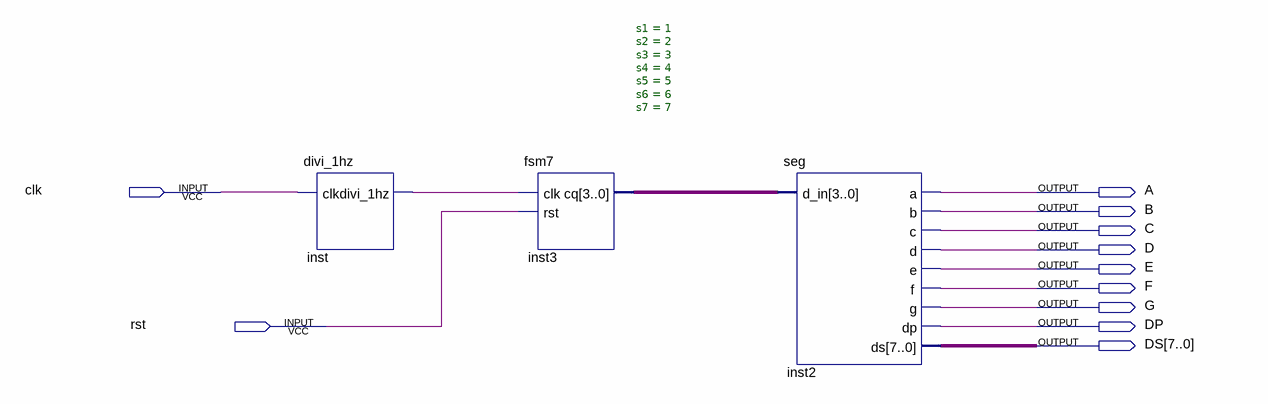
[diagram p0: schematic sheet]
// Quartus schematic ArbCodeCnt.bdf as structural Verilog: 3 symbols, 11 pins
module ArbCodeCnt (
  input  clk,
  input  rst,
  output A,
  output B,
  output C,
  output D,
  output E,
  output F,
  output G,
  output DP,
  output [7:0] DS
);

  wire inst_divi_1hz;
  wire [3:0] inst3_cq;

  divi_1hz inst (.clk(clk), .divi_1hz(inst_divi_1hz));
  fsm7 #(.s1(1), .s2(2), .s3(3), .s4(4), .s5(5), .s6(6), .s7(7)) inst3 (.clk(inst_divi_1hz), .rst(rst), .cq(inst3_cq));
  seg inst2 (.d_in(inst3_cq), .a(A), .b(B), .c(C), .d(D), .e(E), .f(F), .g(G), .dp(DP), .ds(DS));
endmodule
